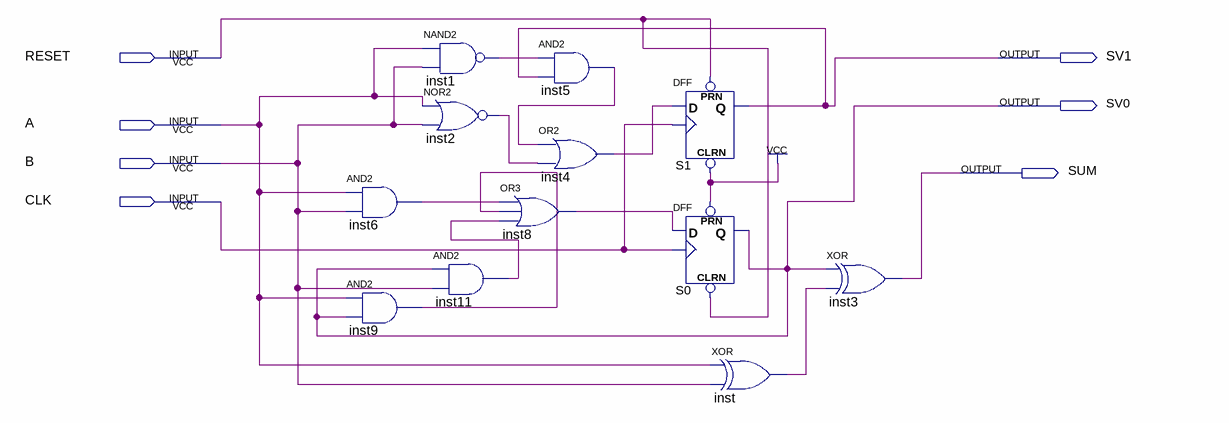
[diagram p0: schematic sheet]
// Quartus schematic seq_adder.bdf as structural Verilog: 12 symbols, 7 pins
module seq_adder (
  input  RESET,
  input  A,
  input  B,
  input  CLK,
  output SV1,
  output SV0,
  output SUM
);

  wire inst1_out, inst2_out, inst4_out, inst5_out, inst6_out, inst8_out, inst9_out, inst11_out, inst_out;

  and inst6 (inst6_out, A, B);
  and inst9 (inst9_out, A, SV0);
  nand inst1 (inst1_out, A, B);
  nor inst2 (inst2_out, A, B);
  and inst11 (inst11_out, SV0, B);
  and inst5 (inst5_out, inst1_out, SV1);
  or inst4 (inst4_out, inst5_out, inst2_out);
  or inst8 (inst8_out, inst6_out, inst9_out, inst11_out);
  DFF S1 (.CLRN(1'b1), .CLK(CLK), .D(inst4_out), .PRN(RESET), .Q(SV1));
  DFF S0 (.CLRN(RESET), .CLK(CLK), .D(inst8_out), .PRN(1'b1), .Q(SV0));
  xor inst (inst_out, A, B);
  xor inst3 (SUM, SV0, inst_out);
endmodule
